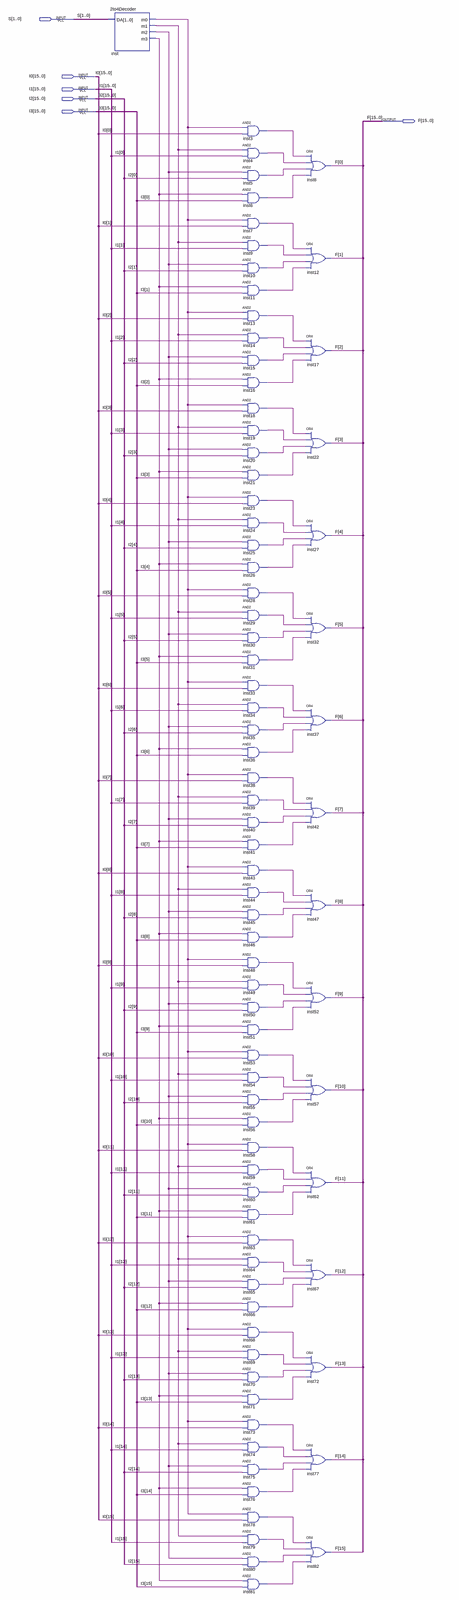
[diagram p0: schematic sheet, whole]
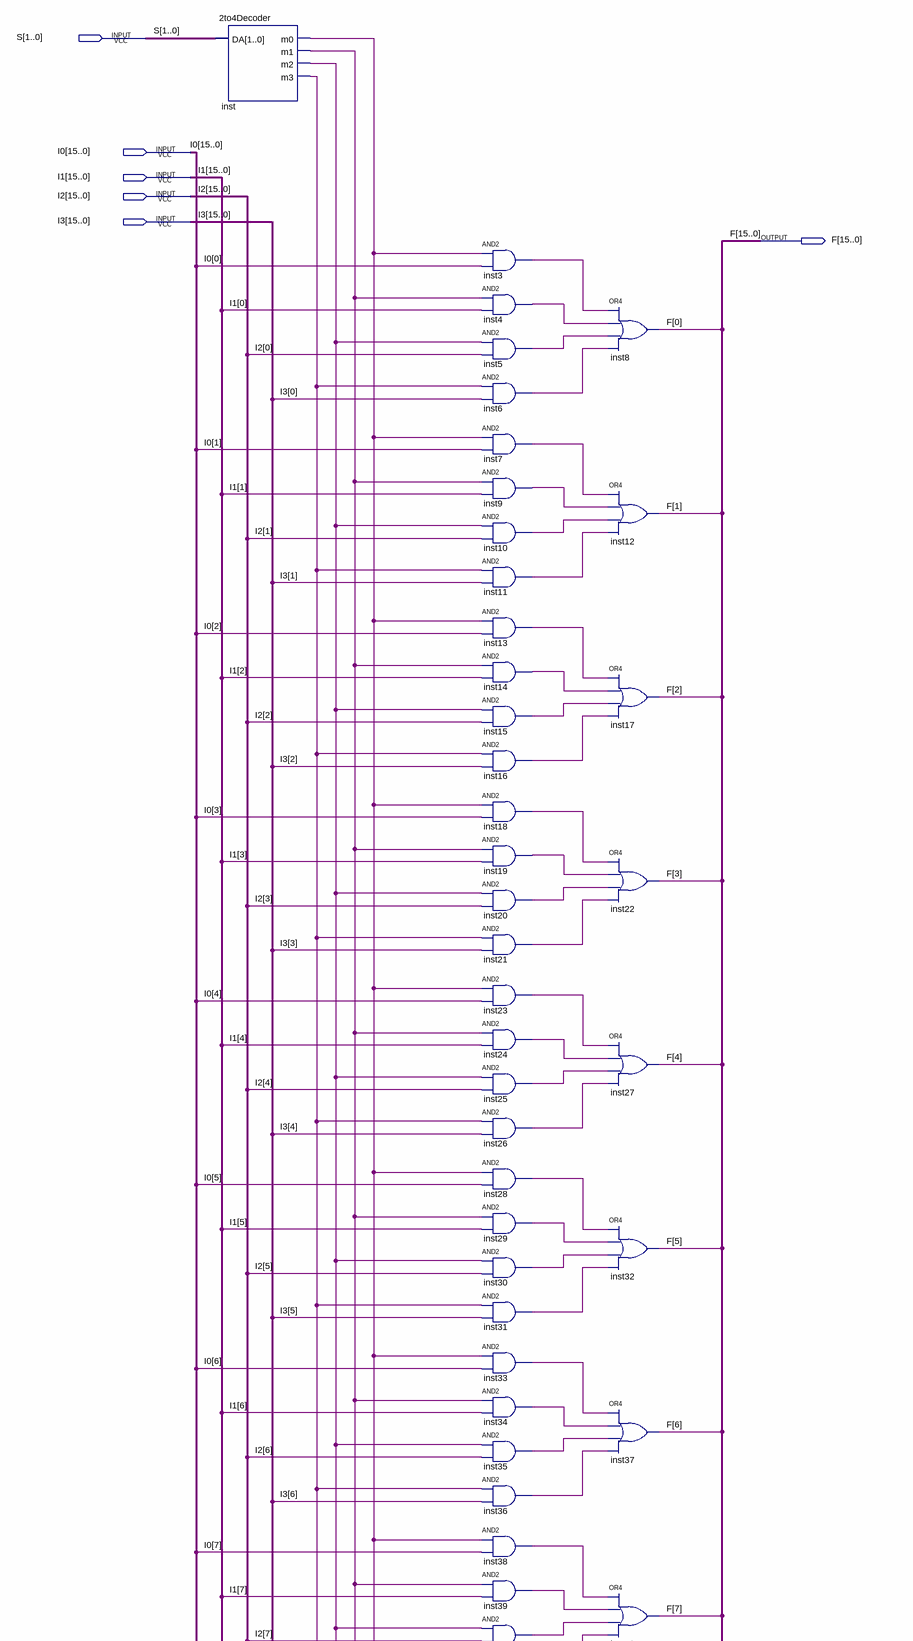
[diagram p1: schematic sheet, upper part]
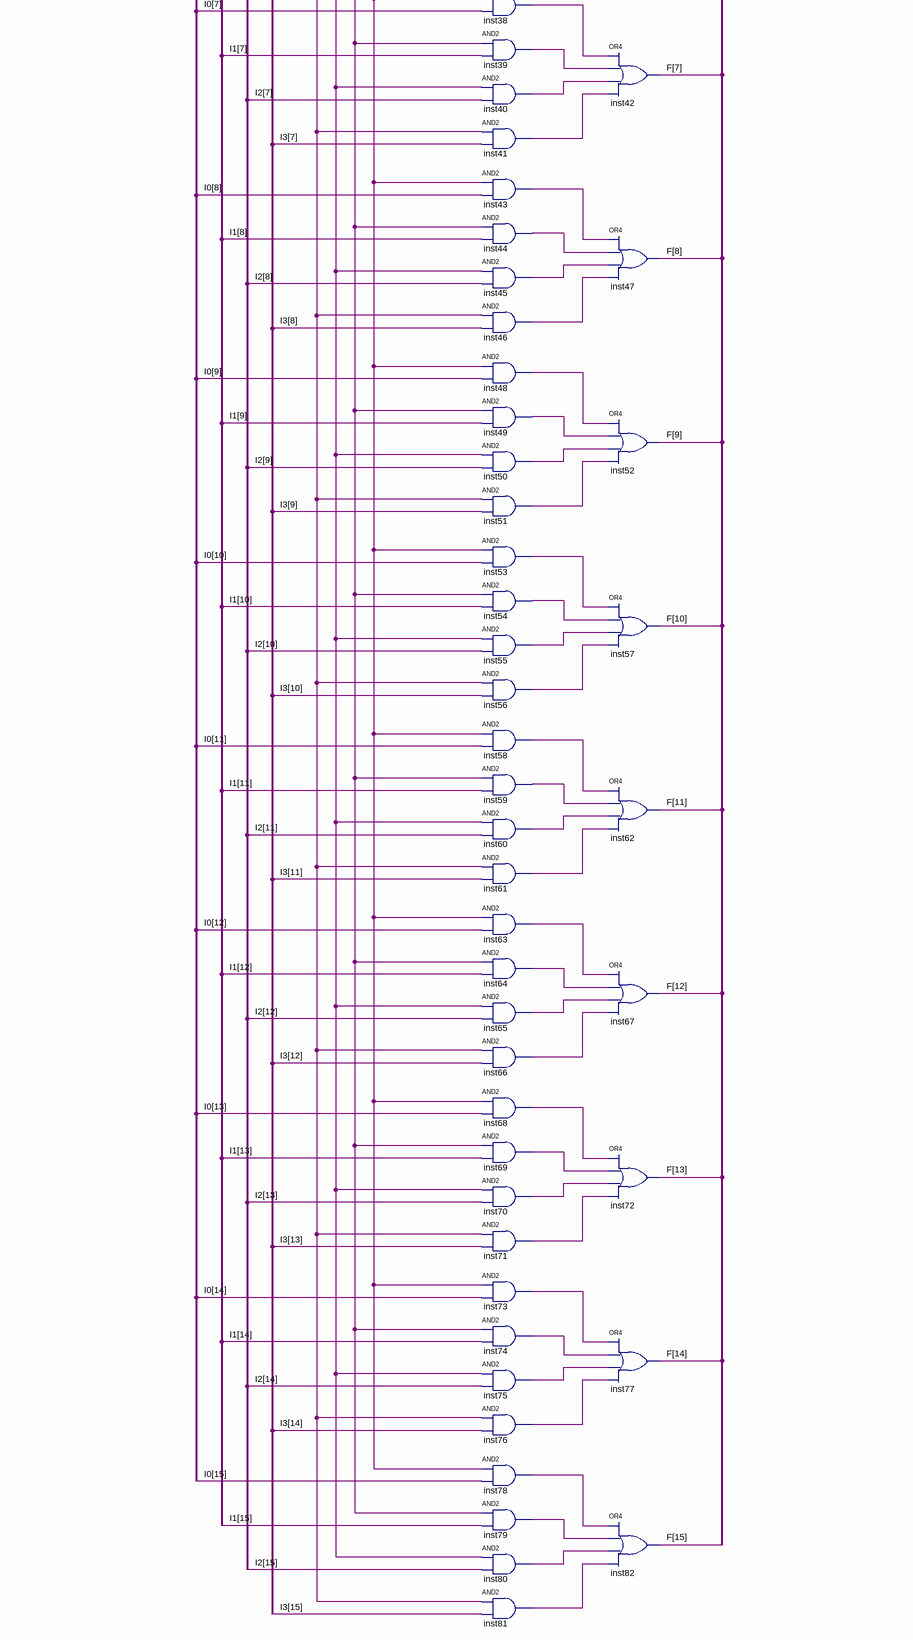
[diagram p2: schematic sheet, lower part]
// Quartus schematic 4by16Mux.bdf as structural Verilog: 81 symbols, 6 pins
module \4by16Mux  (
  input  [1:0] S,
  input  [15:0] I0,
  input  [15:0] I1,
  input  [15:0] I2,
  input  [15:0] I3,
  output [15:0] F
);

  wire inst3_out, inst4_out, inst5_out, inst6_out, inst7_out, inst9_out, inst10_out, inst11_out, inst13_out,
       inst14_out, inst15_out, inst16_out, inst18_out, inst19_out, inst20_out, inst21_out, inst23_out,
       inst24_out, inst25_out, inst26_out, inst28_out, inst29_out, inst30_out, inst31_out, inst33_out,
       inst34_out, inst35_out, inst36_out, inst38_out, inst39_out, inst40_out, inst41_out, inst43_out,
       inst44_out, inst45_out, inst46_out, inst48_out, inst49_out, inst50_out, inst51_out, inst53_out,
       inst54_out, inst55_out, inst56_out, inst58_out, inst59_out, inst60_out, inst61_out, inst63_out,
       inst64_out, inst65_out, inst66_out, inst68_out, inst69_out, inst70_out, inst71_out, inst73_out,
       inst74_out, inst75_out, inst76_out, inst78_out, inst79_out, inst80_out, inst81_out, inst_m0, inst_m1,
       inst_m2, inst_m3;

  \2to4Decoder  inst (.DA(S), .m0(inst_m0), .m1(inst_m1), .m2(inst_m2), .m3(inst_m3));
  and inst3 (inst3_out, inst_m0, I0[0]);
  and inst4 (inst4_out, inst_m1, I1[0]);
  and inst5 (inst5_out, inst_m2, I2[0]);
  and inst6 (inst6_out, inst_m3, I3[0]);
  and inst7 (inst7_out, inst_m0, I0[1]);
  and inst9 (inst9_out, inst_m1, I1[1]);
  and inst10 (inst10_out, inst_m2, I2[1]);
  and inst11 (inst11_out, inst_m3, I3[1]);
  and inst13 (inst13_out, inst_m0, I0[2]);
  and inst14 (inst14_out, inst_m1, I1[2]);
  and inst15 (inst15_out, inst_m2, I2[2]);
  and inst16 (inst16_out, inst_m3, I3[2]);
  and inst18 (inst18_out, inst_m0, I0[3]);
  and inst19 (inst19_out, inst_m1, I1[3]);
  and inst20 (inst20_out, inst_m2, I2[3]);
  and inst21 (inst21_out, inst_m3, I3[3]);
  and inst23 (inst23_out, inst_m0, I0[4]);
  and inst24 (inst24_out, inst_m1, I1[4]);
  and inst25 (inst25_out, inst_m2, I2[4]);
  and inst26 (inst26_out, inst_m3, I3[4]);
  and inst28 (inst28_out, inst_m0, I0[5]);
  and inst29 (inst29_out, inst_m1, I1[5]);
  and inst30 (inst30_out, inst_m2, I2[5]);
  and inst31 (inst31_out, inst_m3, I3[5]);
  and inst33 (inst33_out, inst_m0, I0[6]);
  and inst34 (inst34_out, inst_m1, I1[6]);
  and inst35 (inst35_out, inst_m2, I2[6]);
  and inst36 (inst36_out, inst_m3, I3[6]);
  and inst38 (inst38_out, inst_m0, I0[7]);
  and inst39 (inst39_out, inst_m1, I1[7]);
  and inst40 (inst40_out, inst_m2, I2[7]);
  and inst41 (inst41_out, inst_m3, I3[7]);
  and inst43 (inst43_out, inst_m0, I0[8]);
  and inst44 (inst44_out, inst_m1, I1[8]);
  and inst45 (inst45_out, inst_m2, I2[8]);
  and inst46 (inst46_out, inst_m3, I3[8]);
  and inst48 (inst48_out, inst_m0, I0[9]);
  and inst49 (inst49_out, inst_m1, I1[9]);
  and inst50 (inst50_out, inst_m2, I2[9]);
  and inst51 (inst51_out, inst_m3, I3[9]);
  and inst53 (inst53_out, inst_m0, I0[10]);
  and inst54 (inst54_out, inst_m1, I1[10]);
  and inst55 (inst55_out, inst_m2, I2[10]);
  and inst56 (inst56_out, inst_m3, I3[10]);
  and inst58 (inst58_out, inst_m0, I0[11]);
  and inst59 (inst59_out, inst_m1, I1[11]);
  and inst60 (inst60_out, inst_m2, I2[11]);
  and inst61 (inst61_out, inst_m3, I3[11]);
  and inst63 (inst63_out, inst_m0, I0[12]);
  and inst64 (inst64_out, inst_m1, I1[12]);
  and inst65 (inst65_out, inst_m2, I2[12]);
  and inst66 (inst66_out, inst_m3, I3[12]);
  and inst68 (inst68_out, inst_m0, I0[13]);
  and inst69 (inst69_out, inst_m1, I1[13]);
  and inst70 (inst70_out, inst_m2, I2[13]);
  and inst71 (inst71_out, inst_m3, I3[13]);
  and inst73 (inst73_out, inst_m0, I0[14]);
  and inst74 (inst74_out, inst_m1, I1[14]);
  and inst75 (inst75_out, inst_m2, I2[14]);
  and inst76 (inst76_out, inst_m3, I3[14]);
  and inst78 (inst78_out, inst_m0, I0[15]);
  and inst79 (inst79_out, inst_m1, I1[15]);
  and inst80 (inst80_out, inst_m2, I2[15]);
  and inst81 (inst81_out, inst_m3, I3[15]);
  or inst8 (F[0], inst3_out, inst4_out, inst5_out, inst6_out);
  or inst12 (F[1], inst7_out, inst9_out, inst10_out, inst11_out);
  or inst17 (F[2], inst13_out, inst14_out, inst15_out, inst16_out);
  or inst22 (F[3], inst18_out, inst19_out, inst20_out, inst21_out);
  or inst27 (F[4], inst23_out, inst24_out, inst25_out, inst26_out);
  or inst32 (F[5], inst28_out, inst29_out, inst30_out, inst31_out);
  or inst37 (F[6], inst33_out, inst34_out, inst35_out, inst36_out);
  or inst42 (F[7], inst38_out, inst39_out, inst40_out, inst41_out);
  or inst47 (F[8], inst43_out, inst44_out, inst45_out, inst46_out);
  or inst52 (F[9], inst48_out, inst49_out, inst50_out, inst51_out);
  or inst57 (F[10], inst53_out, inst54_out, inst55_out, inst56_out);
  or inst62 (F[11], inst58_out, inst59_out, inst60_out, inst61_out);
  or inst67 (F[12], inst63_out, inst64_out, inst65_out, inst66_out);
  or inst72 (F[13], inst68_out, inst69_out, inst70_out, inst71_out);
  or inst77 (F[14], inst73_out, inst74_out, inst75_out, inst76_out);
  or inst82 (F[15], inst78_out, inst79_out, inst80_out, inst81_out);
endmodule
